# EAGLE schematic PCB (EAGLE 8.6.1)
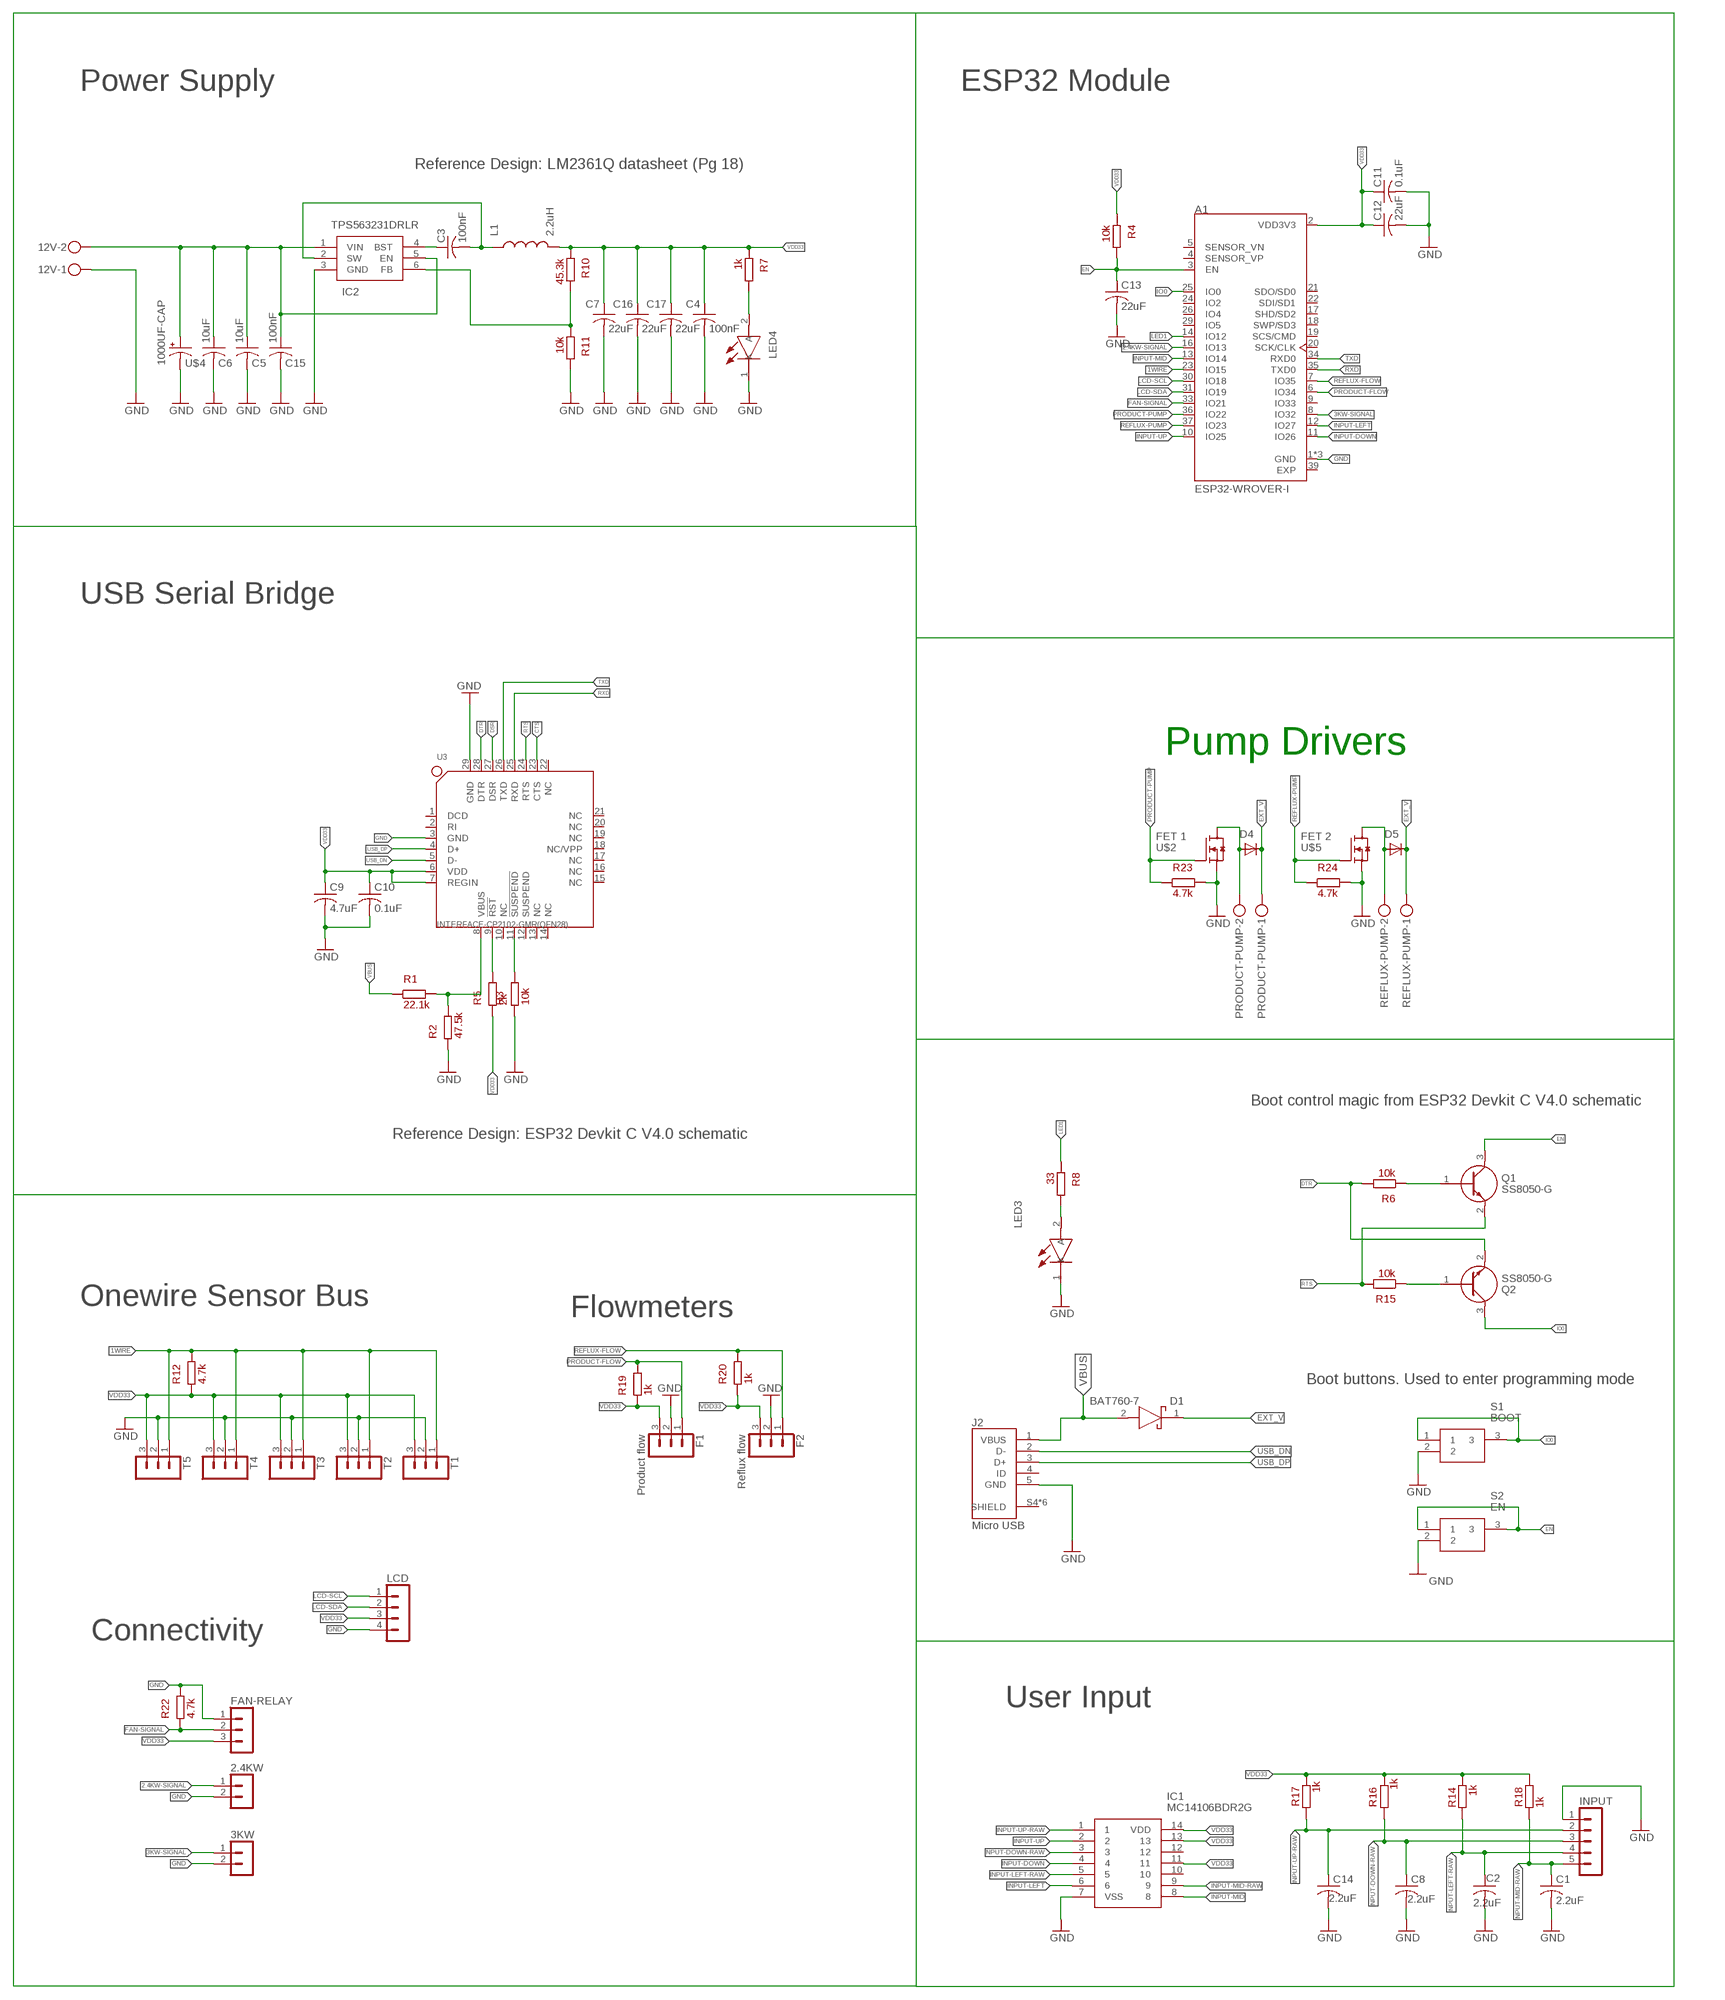
[diagram p0: schematic, sheet 1]

## Parts
2.4KW  53398-0210  [53398-0210]
3KW  53398-0210  [53398-0210]
12V  MKDSN1,5/2-5,08  [MKDSN1,5/2-5,08]
A1  ESP32-WROVER-I  [XCVR_ESP32-WROVER-I]
C1  2.2uF  C-USC0805K  [C0805K]
C2  2.2uF  C-USC0805K  [C0805K]
C3  100nF  C-USC0805K  [C0805K]
C4  100nF  C-USC0805K  [C0805K]
C5  10uF  C-USC0805K  [C0805K]
C6  10uF  C-USC0805K  [C0805K]
C7  22uF  C-USC0805K  [C0805K]
C8  2.2uF  C-USC0805K  [C0805K]
C9  4.7uF  C-USC0805K  [C0805K]
C10  0.1uF  C-USC0805K  [C0805K]
C11  0.1uF  C-USC0805K  [C0805K]
C12  22uF  C-USC0805K  [C0805K]
C13  22uF  C-USC0805K  [C0805K]
C14  2.2uF  C-USC0805K  [C0805K]
C15  100nF  C-USC0805K  [C0805K]
C16  22uF  C-USC0805K  [C0805K]
C17  22uF  C-USC0805K  [C0805K]
D1  BAT760-7  [SOD2513X120N]
D4  RB095BGE-40TL  [TO252]
D5  RB095BGE-40TL  [TO252]
F1  Product flow  53398-0310  [53398-0310]
F2  Reflux flow  53398-0310  [53398-0310]
FAN-RELAY  53398-0310  [53398-0310]
IC1  MC14106BDR2G  [SOIC127P600X175-14N]
IC2  TPS563231DRLR  [SOTFL50P160X60-6N]
INPUT  53398-0510  [53398-0510]
J2  Micro USB  2040002-1  [TE_2040002-1]
L1  2.2uH  LB3218T2R2M  [LB3218T2R2M]
LCD  53398-0410  [53398-0410]
LED3  SML-H12V8TT86C  [LEDC2012X80N]
LED4  SML-H12V8TT86C  [LEDC2012X80N]
PRODUCT-PUMP  MKDSN1,5/2-5,08  [MKDSN1,5/2-5,08]
Q1  SS8050-G  [SOT95P240X115-3N]
Q2  SS8050-G  [SOT95P240X115-3N]
R1  22.1k  RESISTOR-0805  [C0805K]
R2  47.5k  RESISTOR-0805  [C0805K]
R3  10k  RESISTOR-0805  [C0805K]
R4  10k  RESISTOR-0805  [C0805K]
R5  2k  RESISTOR-0805  [C0805K]
R6  10k  RESISTOR-0805  [C0805K]
R7  1k  RESISTOR-0805  [C0805K]
R8  33  RESISTOR-0805  [C0805K]
R10  45.3k  RESISTOR-0805  [C0805K]
R11  10k  RESISTOR-0805  [C0805K]
R12  4.7k  RESISTOR-0805  [C0805K]
R14  1k  RESISTOR-0805  [C0805K]
R15  10k  RESISTOR-0805  [C0805K]
R16  1k  RESISTOR-0805  [C0805K]
R17  1k  RESISTOR-0805  [C0805K]
R18  1k  RESISTOR-0805  [C0805K]
R19  1k  RESISTOR-0805  [C0805K]
R20  1k  RESISTOR-0805  [C0805K]
R22  4.7k  RESISTOR-0805  [C0805K]
R23  4.7k  RESISTOR-0805  [C0805K]
R24  4.7k  RESISTOR-0805  [C0805K]
REFLUX-PUMP  MKDSN1,5/2-5,08  [MKDSN1,5/2-5,08]
S1  BOOT  TL3340AF160QG  [TL3340]
S2  EN  TL3340AF160QG  [TL3340]
T1  53398-0310  [53398-0310]
T2  53398-0310  [53398-0310]
T3  53398-0310  [53398-0310]
T4  53398-0310  [53398-0310]
T5  53398-0310  [53398-0310]
U3  INTERFACE-CP2102-GMR(QFN28)  [QFN28G_0.5-5X5MM]
U$2  FET 1  STD19N3LLH6AG  [TO252]
U$4  1000UF-CAP  [UNITED-CHEMICON-SMD-CAP-1000UF]
U$5  FET 2  STD19N3LLH6AG  [TO252]

## Nets
1WIRE: A1.23(IO15) R12.2 T1.1 T2.1 T3.1 T4.1 T5.1
2.4KW-SIGNAL: 2.4KW.1 A1.16(IO13)
3KW-SIGNAL: 3KW.1 A1.8(IO32)
BST: C3.1 IC2.4(BST)
CTS: U3.23(CTS)
DSR: U3.27(DSR)
DTR: Q2.2(E) R6.2 U3.28(DTR)
EN: A1.3(EN) C13.1 Q1.3(C) R4.2 S2.1 S2.3
EXT_V: 12V.2 C5.1 C6.1 C15.1 D1.1(K) D4.2(C) D5.2(C) IC2.1(VIN) IC2.5(EN) PRODUCT-PUMP.1 REFLUX-PUMP.1 U$4.+
FAN-SIGNAL: A1.33(IO21) FAN-RELAY.2 R22.1
GND: 2.4KW.2 3KW.2 12V.1 A1.1(GND) A1.15(GND) A1.38(GND) C1.2 C2.2 C4.2 C5.2 C6.2 C7.2 C8.2 C9.2 C10.2 C11.2 C12.2 C13.2 C14.2 C15.2 C16.2 C17.2 F1.2 F2.2 FAN-RELAY.1 IC1.7(VSS) IC2.3(GND) INPUT.1 J2.5(GND) LCD.4 LED3.1(K) LED4.1(K) R2.1 R3.1 R11.2 R22.2 R23.2 R24.2 S1.2 S2.2 T1.2 T2.2 T3.2 T4.2 T5.2 U3.3(GND) U3.29(GND) U$2.3(S) U$4.- U$5.3(S)
INPUT-DOWN: A1.11(IO26) IC1.4
INPUT-DOWN-RAW: C8.1 IC1.3 INPUT.3 R16.1
INPUT-LEFT: A1.12(IO27) IC1.6
INPUT-LEFT-RAW: C2.1 IC1.5 INPUT.4 R14.1
INPUT-MID: A1.13(IO14) IC1.8
INPUT-MID-RAW: C1.1 IC1.9 INPUT.5 R18.1
INPUT-UP: A1.10(IO25) IC1.2
INPUT-UP-RAW: C14.1 IC1.1 INPUT.2 R17.1
IO0: A1.25(IO0) Q2.3(C) S1.1 S1.3
LCD-SCL: A1.30(IO18) LCD.1
LCD-SDA: A1.31(IO19) LCD.2
LED1: A1.14(IO12) R8.1
N$1: R3.2 U3.11(!SUSPEND)
N$2: R5.2 U3.9(!RST)
N$3: R1.2 R2.2 U3.8(VBUS)
N$6: LED4.2(A) R7.2
N$7: LED3.2(A) R8.2
N$13: IC2.6(FB) R10.2 R11.1
N$14: D4.1(A) D4.3(A) PRODUCT-PUMP.2 U$2.2(D)
N$16: D5.1(A) D5.3(A) REFLUX-PUMP.2 U$5.2(D)
N$19: Q1.1(B) R6.1
N$20: Q2.1(B) R15.1
PRODUCT-FLOW: A1.6(IO34) F1.1 R19.2
PRODUCT-PUMP: A1.36(IO22) R23.1 U$2.1(G)
REFLUX-FLOW: A1.7(IO35) F2.1 R20.2
REFLUX-PUMP: A1.37(IO23) R24.1 U$5.1(G)
RTS: Q1.2(E) R15.2 U3.24(RTS)
RXD: A1.35(TXD0) U3.25(RXD)
SW: C3.2 IC2.2(SW) L1.P$1
TXD: A1.34(RXD0) U3.26(TXD)
USB_DN: J2.2(D-) U3.5(D-)
USB_DP: J2.3(D+) U3.4(D+)
VBUS: D1.2(A) J2.1(VBUS) R1.1
VDD33: A1.2(VDD3V3) C4.1 C7.1 C9.1 C10.1 C11.1 C12.1 C16.1 C17.1 F1.3 F2.3 FAN-RELAY.3 IC1.11 IC1.13 IC1.14(VDD) L1.P$2 LCD.3 R4.1 R5.1 R7.1 R10.1 R12.1 R14.2 R16.2 R17.2 R18.2 R19.1 R20.1 T1.3 T2.3 T3.3 T4.3 T5.3 U3.6(VDD) U3.7(REGIN)
Unconnected: A1.4(SENSOR_VP) A1.5(SENSOR_VN) A1.9(IO33) A1.17(SHD/SD2) A1.18(SWP/SD3) A1.19(SCS/CMD) A1.20(SCK/CLK) A1.21(SDO/SD0) A1.22(SDI/SD1) A1.24(IO2) A1.26(IO4) A1.29(IO5) IC1.10 IC1.12 J2.4(ID) U3.1(DCD) U3.2(RI) U3.10(NC) U3.12(SUSPEND) U3.13(NC) U3.14(NC) U3.15(NC) U3.16(NC) U3.17(NC) U3.18(NC/VPP) U3.19(NC) U3.20(NC) U3.21(NC) U3.22(NC)

## Notes on the sheet
- Power Supply | ESP32 Module
- Reference Design: LM2361Q datasheet (Pg 18)
- USB Serial Bridge
- Pump Drivers
- Boot control magic from ESP32 Devkit C V4.0 schematic
- Reference Design: ESP32 Devkit C V4.0 schematic
- Onewire Sensor Bus
- Flowmeters
- Boot buttons. Used to enter programming mode
- Connectivity
- User Input

## Power pins joined to a net without a drawn wire
EXP: A1.39(EXP)
SHIELD: J2.S4(SHIELD) J2.S5(SHIELD) J2.SH1(SHIELD) J2.SH2(SHIELD) J2.SH3(SHIELD) J2.SH4(SHIELD)

## Library data of the parts
2.4KW 3KW = con-molex-picoblade:53398-0210: HEADER; OC_FARNELL: unknown
12V PRODUCT-PUMP REFLUX-PUMP = con-phoenix-508:MKDSN1,5/2-5,08: MKDSN 1,5/ 2-5,08 Printklemme Nennstrom: 13,5 A Nennspannung: 250 V Rastermaß: 5,08 mm Polzahl: 2 Anschlussart: Schraubanschluss Montage: Löten Anschlussrichtung Leiter/Platine: 0 ° Artikelnummer: 1729128 Source: http://eshop.phoenixcontact.com .. 1729128.pdf; OC_FARNELL: unknown
A1 = ESP32-WROVER-I:ESP32-WROVER-I: Module: combo; GPIO, I2C x2, I2S x2, SDIO, SPI x3, UART x3; U.FL; AVAILABILITY: Unavailable; DESCRIPTION: Module: combo; GPIO, I2C x2, I2S x2, SDIO, SPI x3, UART x3; U.FL; MF: Espressif Systems; MP: ESP32-WROVER-I; PACKAGE: Module Espressif Systems; PRICE: None
C1-C17 = adafruit:C-US: CAPACITOR, American symbol
D1 = BAT760-7:BAT760-7: Diode Schottky 30V 1A 2Pin SOD323 Diodes Inc BAT760-7, SMT Schottky Diode, 30V 1A, 2-Pin SOD-323 Source: Datasheet <https://www.diodes.com/assets/Datasheets/ds30498.pdf>; ALLIED_NUMBER: 70437639; ALLIED_PRICE-STOCK: https://www.alliedelec.com/diodes-inc-bat760-7/70437639/; DESCRIPTION: Diode Schottky 30V 1A 2Pin SOD323 Diodes Inc BAT760-7, SMT Schottky Diode, 30V 1A, 2-Pin SOD-323; HEIGHT: 1.2mm; MANUFACTURER_NAME: Diodes Inc.; MANUFACTURER_PART_NUMBER: BAT760-7; MOUSER_PART_NUMBER: 621-BAT760-7; MOUSER_PRICE-STOCK: https://www.mouser.com/Search/Refine.aspx?Keyword=621-BAT760-7; RS_PART_NUMBER: 7513427; RS_PRICE-STOCK: https://uk.rs-online.com/web/p/products/7513427
D4 D5 = My Parts:RB095BGE-40TL; MF: BOURNS; MPN: PWR163S-25-2R20JE; OC_FARNELL: 2813921
F1 F2 FAN-RELAY T1-T5 = con-molex-picoblade:53398-0310: HEADER; OC_FARNELL: unknown
IC1 = MC14106BDR2G:MC14106BDR2G: Source: Datasheet <http://www.onsemi.com/pub/Collateral/MC14106B-D.PDF>; ALLIED_NUMBER: 70339962; ALLIED_PRICE-STOCK: http://www.alliedelec.com/on-semiconductor-mc14106bdr2g/70339962/; HEIGHT: 1.75mm; MANUFACTURER_NAME: ON Semiconductor; MANUFACTURER_PART_NUMBER: MC14106BDR2G; MOUSER_PART_NUMBER: 863-MC14106BDR2G; MOUSER_PRICE-STOCK: https://www.mouser.com/Search/Refine.aspx?Keyword=863-MC14106BDR2G; RS_PART_NUMBER: 6881546P; RS_PRICE-STOCK: http://uk.rs-online.com/web/p/products/6881546P
IC2 = TPS563231DRLR:TPS563231DRLR: 4.5-V to 17-V input, 3-A synchronous step-down voltage regulator Source: Datasheet <http://www.ti.com/lit/gpn/TPS563231>; DESCRIPTION: 4.5-V to 17-V input, 3-A synchronous step-down voltage regulator; HEIGHT: 0.6mm; MANUFACTURER_NAME: Texas Instruments; MANUFACTURER_PART_NUMBER: TPS563231DRLR; MOUSER_PART_NUMBER: 595-TPS563231DRLR; MOUSER_PRICE-STOCK: https://www.mouser.com/Search/Refine.aspx?Keyword=595-TPS563231DRLR
INPUT = con-molex-picoblade:53398-0510: HEADER; OC_FARNELL: unknown
J2 = 2040002-1:2040002-1: Conn USB Type B RCP 5 POS 0.65mm Solder RA SMD 5 Terminal 1 Port T/R; AVAILABILITY: Unavailable; CENTERLINE_PITCH: .65 mm[.025 in]; COMMENT: 2040002-1; DESCRIPTION: Micro USB REC type B DIP 4 legs assy_Au_; MF: TE Connectivity; MP: 2040002-1; NUMBER_OF_POSITIONS: 5; PACKAGE: None; PRICE: None; PRODUCT_TYPE: Connector; TE_PURCHASE_URL: https://www.te.com/usa-en/product-2040002-1.html?te_bu=Cor&te_type=disp&te_campaign=seda_glo_cor-seda-global-disp-prtnr-fy19-seda-model-bom-cta_sma-317_1&elqCampaignId=32493
L1 = My Parts:LB3218T2R2M
LCD = con-molex-picoblade:53398-0410: HEADER; OC_FARNELL: unknown
LED3 LED4 = SML-H12V8TT86C:SML-H12V8TT86C: ROHM - SML-H12V8TT86C - CHIP LED, AEC-Q101, RED, 25MCD, 0805 Source: Datasheet <http://www.rohm.com/web/global/datasheet/SML-H12V8T(C)/sml-h1(c)-e>; DESCRIPTION: ROHM - SML-H12V8TT86C - CHIP LED, AEC-Q101, RED, 25MCD, 0805; HEIGHT: 0.8mm; MANUFACTURER_NAME: ROHM Semiconductor; MANUFACTURER_PART_NUMBER: SML-H12V8TT86C; MOUSER_PART_NUMBER: 755-SML-H12V8TT86C; MOUSER_PRICE-STOCK: https://www.mouser.com/Search/Refine.aspx?Keyword=755-SML-H12V8TT86C
Q1 Q2 = SS8050-G:SS8050-G: Bipolar Transistors - BJT NPN TRANSISTOR 1.5A 40V Source: Datasheet <http://www.comchiptech.com/admin/files/product/SS8050-G RevA181526.pdf>; DESCRIPTION: Bipolar Transistors - BJT NPN TRANSISTOR 1.5A 40V; HEIGHT: 1.15mm; MANUFACTURER_NAME: Comchip Technology; MANUFACTURER_PART_NUMBER: SS8050-G; MOUSER_PART_NUMBER: 750-SS8050-G; MOUSER_PRICE-STOCK: https://www.mouser.com/Search/Refine.aspx?Keyword=750-SS8050-G
R1-R8 R10 R11 R15 = My Parts:RESISTOR-0805
R12 R14 R16-R20 R22-R24 = My Parts:RESISTOR-0805; OC_FARNELL: unknown
S1 S2 = TL3340AF160QG:TL3340AF160QG: E-SWITCH - TL3340AF160QG. - SWITCH, TACTILE SPST 50mA, SMD GULL WING Source: Datasheet <https://www.e-switch.com/system/asset/product_line/data_sheet/164/TL3340.pdf>; DESCRIPTION: E-SWITCH - TL3340AF160QG. - SWITCH, TACTILE SPST 50mA, SMD GULL WING; HEIGHT: mm; MANUFACTURER_NAME: E-Switch; MANUFACTURER_PART_NUMBER: TL3340AF160QG; MOUSER_PART_NUMBER: 612-TL3340AF160QG; MOUSER_PRICE-STOCK: https://www.mouser.com/Search/Refine.aspx?Keyword=612-TL3340AF160QG
U3 = INTERFACE-CP2102-GMR_QFN28_:INTERFACE-CP2102-GMR(QFN28): 310070003; AVAILABILITY: Unavailable; MF: Silicon; MP: CP2102-GMR; PACKAGE: VFQFN-28 Vishay Siliconix; PRICE: None
U$2 U$5 = My Parts:STD19N3LLH6AG
U$4 = My Parts:1000UF-CAP; OC_FARNELL: unknown